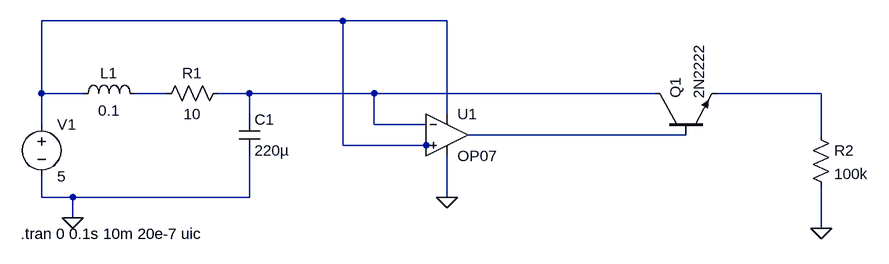
[diagram p0: schematic Draft1sh.asc]
Draft1sh.asc, the LTspice schematic file:
Version 4.1
SHEET 1 1184 680
WIRE 368 -32 -96 -32
WIRE 528 -32 368 -32
WIRE -96 80 -96 -32
WIRE -32 80 -96 80
WIRE 96 80 48 80
WIRE 224 80 176 80
WIRE 416 80 224 80
WIRE 848 80 416 80
WIRE 1104 80 944 80
WIRE 224 112 224 80
WIRE 528 112 528 -32
WIRE -96 128 -96 80
WIRE 416 128 416 80
WIRE 496 128 416 128
WIRE 896 144 560 144
WIRE 1104 144 1104 80
WIRE 368 160 368 -32
WIRE 496 160 368 160
WIRE 496 176 496 160
WIRE -96 240 -96 208
WIRE -48 240 -96 240
WIRE 224 240 224 176
WIRE 224 240 -48 240
WIRE 528 240 528 176
WIRE -48 272 -48 240
WIRE 1104 288 1104 224
FLAG -48 272 0
FLAG 1104 288 0
FLAG 528 240 0
SYMBOL cap 208 112 R0
SYMATTR InstName C1
SYMATTR Value 220µ
SYMBOL ind -48 96 R270
WINDOW 0 32 56 VTop 2
WINDOW 3 5 56 VBottom 2
SYMATTR InstName L1
SYMATTR Value 0.1
SYMBOL res 192 64 R90
WINDOW 0 0 56 VBottom 2
WINDOW 3 32 56 VTop 2
SYMATTR InstName R1
SYMATTR Value 10
SYMBOL voltage -96 112 R0
WINDOW 123 0 0 Left 0
WINDOW 39 0 0 Left 0
SYMATTR InstName V1
SYMATTR Value 5
SYMBOL npn 848 144 R270
SYMATTR InstName Q1
SYMATTR Value 2N2222
SYMBOL OpAmps\\OP07 528 80 R0
SYMATTR InstName U1
SYMBOL res 1088 128 R0
SYMATTR InstName R2
SYMATTR Value 100k
TEXT -128 296 Left 2 !.tran 0 0.1s 10m 20e-7 uic

The netlist it stands for:
* Draft1sh.asc
C1 N003 0 220µ
L1 N001 N002 0.1
R1 N003 N002 10
V1 N001 0 5
Q1 N003 N005 N004 0 2N2222
X§U1 N001 N003 N001 0 N005 LT1001  ; OP07, pins In+ In- V+ V- OUT
R2 N004 0 100k
.model NPN NPN
.model PNP PNP
.lib standard.bjt
.tran 0 0.1s 10m 20e-7 uic
.lib LTC.lib
.backanno
.end